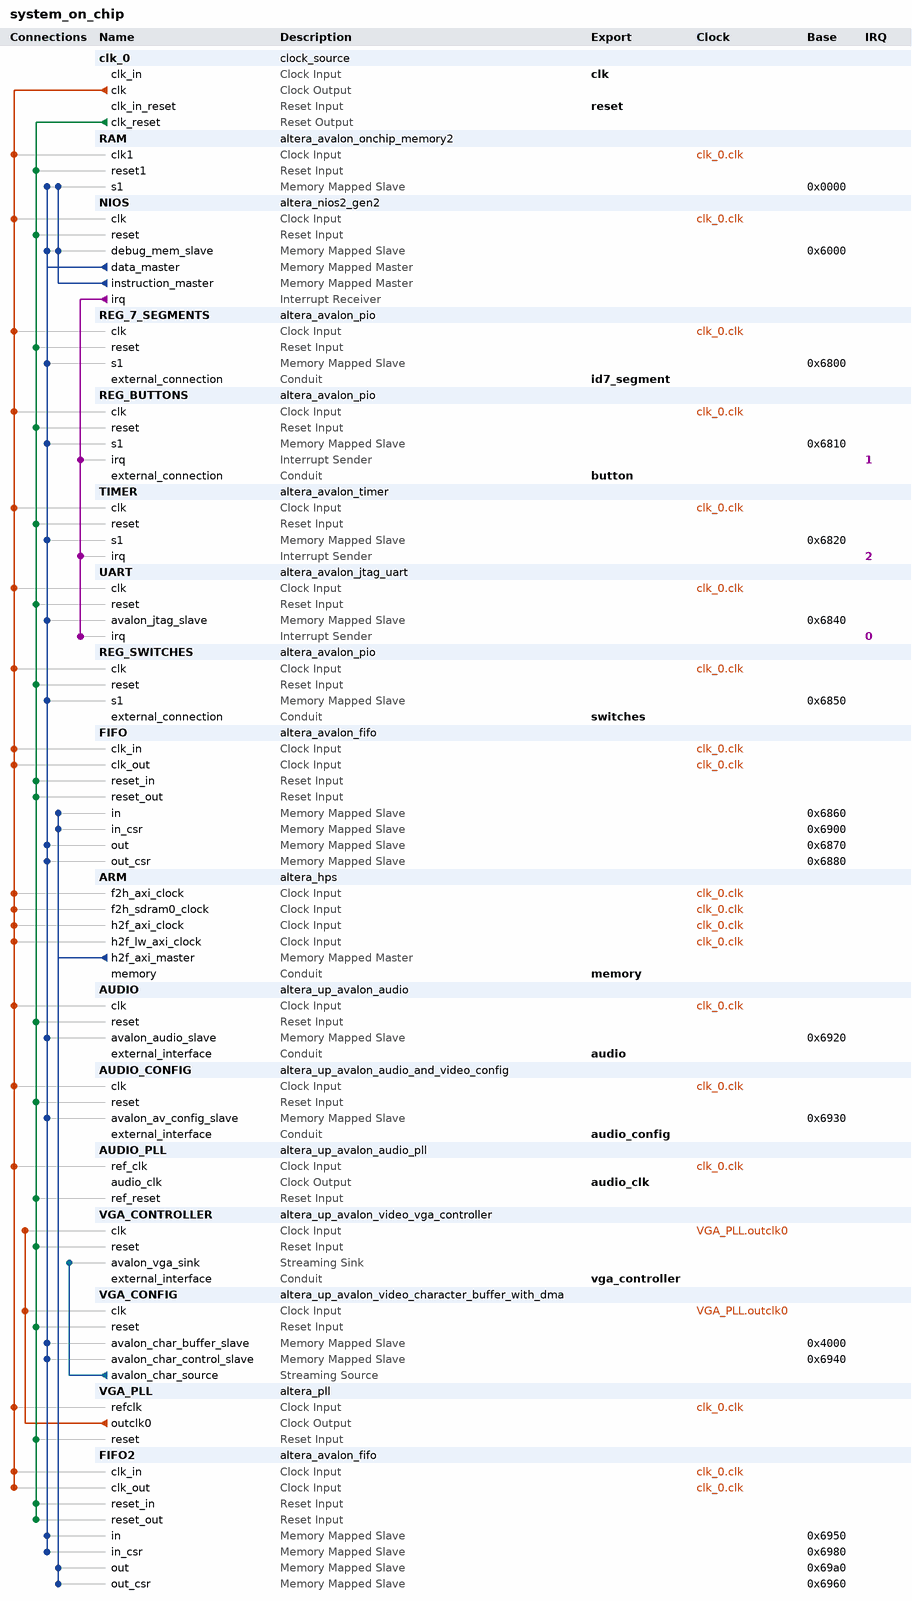
[diagram p0: system contents]
# Platform Designer (Qsys) system system_on_chip, Cyclone V 5CSEMA5F31C6
# Parameters at their usual value, and those the tool derives, are not listed.
package require -exact qsys 18.0
create_system system_on_chip
set_project_property DEVICE_FAMILY {Cyclone V}
set_project_property DEVICE 5CSEMA5F31C6

add_instance clk_0 clock_source 18.0
set_instance_parameter_value clk_0 clockFrequency 50000000

add_instance RAM altera_avalon_onchip_memory2 18.0
set_instance_parameter_value RAM dataWidth 16
set_instance_parameter_value RAM dualPort false
set_instance_parameter_value RAM initMemContent true
set_instance_parameter_value RAM initializationFileName onchip_mem.hex
set_instance_parameter_value RAM memorySize 16384

add_instance NIOS altera_nios2_gen2 18.0
set_instance_parameter_value NIOS dcache_size 2048
set_instance_parameter_value NIOS exceptionSlave RAM.s1
set_instance_parameter_value NIOS icache_size 4096
set_instance_parameter_value NIOS impl Tiny
set_instance_parameter_value NIOS resetSlave RAM.s1

add_instance REG_7_SEGMENTS altera_avalon_pio 18.0
set_instance_parameter_value REG_7_SEGMENTS direction Output
set_instance_parameter_value REG_7_SEGMENTS width 32

add_instance REG_BUTTONS altera_avalon_pio 18.0
set_instance_parameter_value REG_BUTTONS bitClearingEdgeCapReg true
set_instance_parameter_value REG_BUTTONS captureEdge true
set_instance_parameter_value REG_BUTTONS direction Input
set_instance_parameter_value REG_BUTTONS edgeType FALLING
set_instance_parameter_value REG_BUTTONS generateIRQ true
set_instance_parameter_value REG_BUTTONS irqType EDGE
set_instance_parameter_value REG_BUTTONS width 4

add_instance TIMER altera_avalon_timer 18.0
set_instance_parameter_value TIMER period 1
set_instance_parameter_value TIMER periodUnits MSEC

add_instance UART altera_avalon_jtag_uart 18.0
set_instance_parameter_value UART simInteractiveOptions NO_INTERACTIVE_WINDOWS

add_instance REG_SWITCHES altera_avalon_pio 18.0
set_instance_parameter_value REG_SWITCHES direction Input
set_instance_parameter_value REG_SWITCHES edgeType ANY
set_instance_parameter_value REG_SWITCHES width 8

add_instance FIFO altera_avalon_fifo 18.0
set_instance_parameter_value FIFO bitsPerSymbol 16
set_instance_parameter_value FIFO channelWidth 8
set_instance_parameter_value FIFO errorWidth 8
set_instance_parameter_value FIFO fifoDepth 16
set_instance_parameter_value FIFO fifoInputInterfaceOptions AVALONMM_WRITE
set_instance_parameter_value FIFO fifoOutputInterfaceOptions AVALONMM_READ
set_instance_parameter_value FIFO singleClockMode false
set_instance_parameter_value FIFO symbolsPerBeat 2
set_instance_parameter_value FIFO useIRQ true
set_instance_parameter_value FIFO usePacket true
set_instance_parameter_value FIFO useReadControl true

add_instance ARM altera_hps 18.0
set_instance_parameter_value ARM EMAC1_Mode N/A
set_instance_parameter_value ARM EMAC1_PinMuxing Unused
set_instance_parameter_value ARM F2SCLK_COLDRST_Enable false
set_instance_parameter_value ARM F2SCLK_DBGRST_Enable false
set_instance_parameter_value ARM F2SCLK_WARMRST_Enable false
set_instance_parameter_value ARM F2SDRAM_Type AXI-3
set_instance_parameter_value ARM F2SDRAM_Width 64
set_instance_parameter_value ARM F2SINTERRUPT_Enable false
set_instance_parameter_value ARM F2S_Width 2
set_instance_parameter_value ARM FPGA_PERIPHERAL_OUTPUT_CLOCK_FREQ_EMAC0_GTX_CLK 125
set_instance_parameter_value ARM FPGA_PERIPHERAL_OUTPUT_CLOCK_FREQ_EMAC0_MD_CLK 2.5
set_instance_parameter_value ARM FPGA_PERIPHERAL_OUTPUT_CLOCK_FREQ_EMAC1_GTX_CLK 125
set_instance_parameter_value ARM FPGA_PERIPHERAL_OUTPUT_CLOCK_FREQ_EMAC1_MD_CLK 2.5
set_instance_parameter_value ARM HPS_PROTOCOL DDR3
set_instance_parameter_value ARM I2C0_Mode N/A
set_instance_parameter_value ARM I2C0_PinMuxing Unused
set_instance_parameter_value ARM I2C1_Mode N/A
set_instance_parameter_value ARM I2C1_PinMuxing Unused
set_instance_parameter_value ARM LWH2F_Enable true
set_instance_parameter_value ARM MEM_BANKADDR_WIDTH 3
set_instance_parameter_value ARM MEM_CLK_FREQ 300.0
set_instance_parameter_value ARM MEM_CLK_FREQ_MAX 400.0
set_instance_parameter_value ARM MEM_COL_ADDR_WIDTH 8
set_instance_parameter_value ARM MEM_DQ_WIDTH 8
set_instance_parameter_value ARM MEM_DRV_STR RZQ/6
set_instance_parameter_value ARM MEM_ROW_ADDR_WIDTH 12
set_instance_parameter_value ARM MEM_RTT_NOM {ODT Disabled}
set_instance_parameter_value ARM MEM_RTT_WR {Dynamic ODT off}
set_instance_parameter_value ARM MEM_TCL 7
set_instance_parameter_value ARM MEM_TFAW_NS 37.5
set_instance_parameter_value ARM MEM_TINIT_US 499
set_instance_parameter_value ARM MEM_TMRD_CK 3
set_instance_parameter_value ARM MEM_TRAS_NS 40.0
set_instance_parameter_value ARM MEM_TRCD_NS 15.0
set_instance_parameter_value ARM MEM_TREFI_US 7.0
set_instance_parameter_value ARM MEM_TRFC_NS 75.0
set_instance_parameter_value ARM MEM_TRP_NS 15.0
set_instance_parameter_value ARM MEM_TWTR 2
set_instance_parameter_value ARM MEM_VENDOR JEDEC
set_instance_parameter_value ARM MEM_WTCL 6
set_instance_parameter_value ARM MPU_EVENTS_Enable true
set_instance_parameter_value ARM QSPI_Mode N/A
set_instance_parameter_value ARM QSPI_PinMuxing Unused
set_instance_parameter_value ARM REF_CLK_FREQ 125.0
set_instance_parameter_value ARM S2FCLK_USER2CLK 5
set_instance_parameter_value ARM S2F_Width 2
set_instance_parameter_value ARM SDIO_Mode N/A
set_instance_parameter_value ARM SDIO_PinMuxing Unused
set_instance_parameter_value ARM SPIM1_Mode N/A
set_instance_parameter_value ARM SPIM1_PinMuxing Unused
set_instance_parameter_value ARM STM_Enable false
set_instance_parameter_value ARM TIMING_BOARD_AC_SKEW 0.02
set_instance_parameter_value ARM TIMING_BOARD_AC_TO_CK_SKEW 0.0
set_instance_parameter_value ARM TIMING_BOARD_DQ_TO_DQS_SKEW 0.0
set_instance_parameter_value ARM TIMING_BOARD_MAX_CK_DELAY 0.6
set_instance_parameter_value ARM TIMING_BOARD_MAX_DQS_DELAY 0.6
set_instance_parameter_value ARM TIMING_BOARD_SKEW_BETWEEN_DQS 0.02
set_instance_parameter_value ARM TIMING_BOARD_SKEW_CKDQS_DIMM_MAX 0.01
set_instance_parameter_value ARM TIMING_BOARD_SKEW_CKDQS_DIMM_MIN -0.01
set_instance_parameter_value ARM TIMING_BOARD_SKEW_WITHIN_DQS 0.02
set_instance_parameter_value ARM TIMING_TDH 125
set_instance_parameter_value ARM TIMING_TDQSCK 400
set_instance_parameter_value ARM TIMING_TDQSQ 120
set_instance_parameter_value ARM TIMING_TDS 50
set_instance_parameter_value ARM TIMING_TIH 250
set_instance_parameter_value ARM TIMING_TIS 175
set_instance_parameter_value ARM TIMING_TQSH 0.38
set_instance_parameter_value ARM UART0_Mode N/A
set_instance_parameter_value ARM UART0_PinMuxing Unused
set_instance_parameter_value ARM USB1_Mode N/A
set_instance_parameter_value ARM USB1_PinMuxing Unused
set_instance_parameter_value ARM desired_cfg_clk_mhz 100.0
set_instance_parameter_value ARM desired_qspi_clk_mhz 400.0

add_instance AUDIO altera_up_avalon_audio 18.0
set_instance_parameter_value AUDIO audio_in false
set_instance_parameter_value AUDIO avalon_bus_type {Memory Mapped}
set_instance_parameter_value AUDIO dw 32

add_instance AUDIO_CONFIG altera_up_avalon_audio_and_video_config 18.0
set_instance_parameter_value AUDIO_CONFIG audio_in {Microphone to ADC}
set_instance_parameter_value AUDIO_CONFIG bit_length 32
set_instance_parameter_value AUDIO_CONFIG board DE1-SoC
set_instance_parameter_value AUDIO_CONFIG data_format {I2S Format}
set_instance_parameter_value AUDIO_CONFIG line_in_bypass false
set_instance_parameter_value AUDIO_CONFIG sampling_rate {48 kHz}

add_instance AUDIO_PLL altera_up_avalon_audio_pll 18.0
set_instance_parameter_value AUDIO_PLL audio_clk_freq 18.432
set_instance_parameter_value AUDIO_PLL gui_refclk 50.0

add_instance VGA_CONTROLLER altera_up_avalon_video_vga_controller 18.0
set_instance_parameter_value VGA_CONTROLLER board DE1-SoC
set_instance_parameter_value VGA_CONTROLLER resolution {VGA 640x480}

add_instance VGA_CONFIG altera_up_avalon_video_character_buffer_with_dma 18.0
set_instance_parameter_value VGA_CONFIG enable_transparency false

add_instance VGA_PLL altera_pll 18.0
set_instance_parameter_value VGA_PLL gui_device_speed_grade 1
set_instance_parameter_value VGA_PLL gui_number_of_clocks 1
set_instance_parameter_value VGA_PLL gui_operation_mode direct
set_instance_parameter_value VGA_PLL gui_output_clock_frequency0 25.0
set_instance_parameter_value VGA_PLL gui_pll_mode {Integer-N PLL}
set_instance_parameter_value VGA_PLL gui_reference_clock_frequency 50.0
set_instance_parameter_value VGA_PLL gui_use_locked true

add_instance FIFO2 altera_avalon_fifo 18.0
set_instance_parameter_value FIFO2 bitsPerSymbol 16
set_instance_parameter_value FIFO2 channelWidth 8
set_instance_parameter_value FIFO2 errorWidth 8
set_instance_parameter_value FIFO2 fifoDepth 16
set_instance_parameter_value FIFO2 fifoInputInterfaceOptions AVALONMM_WRITE
set_instance_parameter_value FIFO2 fifoOutputInterfaceOptions AVALONMM_READ
set_instance_parameter_value FIFO2 singleClockMode false
set_instance_parameter_value FIFO2 symbolsPerBeat 2
set_instance_parameter_value FIFO2 useIRQ true
set_instance_parameter_value FIFO2 usePacket true
set_instance_parameter_value FIFO2 useReadControl true

# connections
add_connection clk_0.clk ARM.f2h_axi_clock clock
add_connection clk_0.clk ARM.f2h_sdram0_clock clock
add_connection clk_0.clk ARM.h2f_axi_clock clock
add_connection clk_0.clk ARM.h2f_lw_axi_clock clock
add_connection clk_0.clk AUDIO.clk clock
add_connection clk_0.clk AUDIO_CONFIG.clk clock
add_connection clk_0.clk AUDIO_PLL.ref_clk clock
add_connection clk_0.clk FIFO2.clk_in clock
add_connection clk_0.clk FIFO2.clk_out clock
add_connection clk_0.clk FIFO.clk_in clock
add_connection clk_0.clk FIFO.clk_out clock
add_connection clk_0.clk NIOS.clk clock
add_connection clk_0.clk RAM.clk1 clock
add_connection clk_0.clk REG_7_SEGMENTS.clk clock
add_connection clk_0.clk REG_BUTTONS.clk clock
add_connection clk_0.clk REG_SWITCHES.clk clock
add_connection clk_0.clk TIMER.clk clock
add_connection clk_0.clk UART.clk clock
add_connection clk_0.clk VGA_PLL.refclk clock
add_connection VGA_PLL.outclk0 VGA_CONFIG.clk clock
add_connection VGA_PLL.outclk0 VGA_CONTROLLER.clk clock
add_connection clk_0.clk_reset AUDIO.reset reset
add_connection clk_0.clk_reset AUDIO_CONFIG.reset reset
add_connection clk_0.clk_reset AUDIO_PLL.ref_reset reset
add_connection clk_0.clk_reset FIFO2.reset_in reset
add_connection clk_0.clk_reset FIFO2.reset_out reset
add_connection clk_0.clk_reset FIFO.reset_in reset
add_connection clk_0.clk_reset FIFO.reset_out reset
add_connection clk_0.clk_reset NIOS.reset reset
add_connection clk_0.clk_reset RAM.reset1 reset
add_connection clk_0.clk_reset REG_7_SEGMENTS.reset reset
add_connection clk_0.clk_reset REG_BUTTONS.reset reset
add_connection clk_0.clk_reset REG_SWITCHES.reset reset
add_connection clk_0.clk_reset TIMER.reset reset
add_connection clk_0.clk_reset UART.reset reset
add_connection clk_0.clk_reset VGA_CONFIG.reset reset
add_connection clk_0.clk_reset VGA_CONTROLLER.reset reset
add_connection clk_0.clk_reset VGA_PLL.reset reset
add_connection ARM.h2f_axi_master FIFO2.out avalon
set_connection_parameter_value ARM.h2f_axi_master/FIFO2.out baseAddress 0x69a0
add_connection ARM.h2f_axi_master FIFO2.out_csr avalon
set_connection_parameter_value ARM.h2f_axi_master/FIFO2.out_csr baseAddress 0x6960
add_connection ARM.h2f_axi_master FIFO.in avalon
set_connection_parameter_value ARM.h2f_axi_master/FIFO.in baseAddress 0x6860
add_connection ARM.h2f_axi_master FIFO.in_csr avalon
set_connection_parameter_value ARM.h2f_axi_master/FIFO.in_csr baseAddress 0x6900
add_connection NIOS.data_master AUDIO.avalon_audio_slave avalon
set_connection_parameter_value NIOS.data_master/AUDIO.avalon_audio_slave baseAddress 0x6920
add_connection NIOS.data_master AUDIO_CONFIG.avalon_av_config_slave avalon
set_connection_parameter_value NIOS.data_master/AUDIO_CONFIG.avalon_av_config_slave baseAddress 0x6930
add_connection NIOS.data_master FIFO2.in avalon
set_connection_parameter_value NIOS.data_master/FIFO2.in baseAddress 0x6950
add_connection NIOS.data_master FIFO2.in_csr avalon
set_connection_parameter_value NIOS.data_master/FIFO2.in_csr baseAddress 0x6980
add_connection NIOS.data_master FIFO.out avalon
set_connection_parameter_value NIOS.data_master/FIFO.out baseAddress 0x6870
add_connection NIOS.data_master FIFO.out_csr avalon
set_connection_parameter_value NIOS.data_master/FIFO.out_csr baseAddress 0x6880
add_connection NIOS.data_master NIOS.debug_mem_slave avalon
set_connection_parameter_value NIOS.data_master/NIOS.debug_mem_slave baseAddress 0x6000
add_connection NIOS.data_master RAM.s1 avalon
set_connection_parameter_value NIOS.data_master/RAM.s1 baseAddress 0x0000
add_connection NIOS.data_master REG_7_SEGMENTS.s1 avalon
set_connection_parameter_value NIOS.data_master/REG_7_SEGMENTS.s1 baseAddress 0x6800
add_connection NIOS.data_master REG_BUTTONS.s1 avalon
set_connection_parameter_value NIOS.data_master/REG_BUTTONS.s1 baseAddress 0x6810
add_connection NIOS.data_master REG_SWITCHES.s1 avalon
set_connection_parameter_value NIOS.data_master/REG_SWITCHES.s1 baseAddress 0x6850
add_connection NIOS.data_master TIMER.s1 avalon
set_connection_parameter_value NIOS.data_master/TIMER.s1 baseAddress 0x6820
add_connection NIOS.data_master UART.avalon_jtag_slave avalon
set_connection_parameter_value NIOS.data_master/UART.avalon_jtag_slave baseAddress 0x6840
add_connection NIOS.data_master VGA_CONFIG.avalon_char_buffer_slave avalon
set_connection_parameter_value NIOS.data_master/VGA_CONFIG.avalon_char_buffer_slave baseAddress 0x4000
add_connection NIOS.data_master VGA_CONFIG.avalon_char_control_slave avalon
set_connection_parameter_value NIOS.data_master/VGA_CONFIG.avalon_char_control_slave baseAddress 0x6940
add_connection NIOS.instruction_master NIOS.debug_mem_slave avalon
set_connection_parameter_value NIOS.instruction_master/NIOS.debug_mem_slave baseAddress 0x6000
add_connection NIOS.instruction_master RAM.s1 avalon
set_connection_parameter_value NIOS.instruction_master/RAM.s1 baseAddress 0x0000
add_connection VGA_CONFIG.avalon_char_source VGA_CONTROLLER.avalon_vga_sink avalon_streaming
add_connection NIOS.irq REG_BUTTONS.irq interrupt
set_connection_parameter_value NIOS.irq/REG_BUTTONS.irq irqNumber 1
add_connection NIOS.irq TIMER.irq interrupt
set_connection_parameter_value NIOS.irq/TIMER.irq irqNumber 2
add_connection NIOS.irq UART.irq interrupt
set_connection_parameter_value NIOS.irq/UART.irq irqNumber 0

# exported interfaces
add_interface audio conduit end
set_interface_property audio EXPORT_OF AUDIO.external_interface
add_interface audio_clk clock source
set_interface_property audio_clk EXPORT_OF AUDIO_PLL.audio_clk
add_interface audio_config conduit end
set_interface_property audio_config EXPORT_OF AUDIO_CONFIG.external_interface
add_interface button conduit end
set_interface_property button EXPORT_OF REG_BUTTONS.external_connection
add_interface clk clock sink
set_interface_property clk EXPORT_OF clk_0.clk_in
add_interface id7_segment conduit end
set_interface_property id7_segment EXPORT_OF REG_7_SEGMENTS.external_connection
add_interface memory conduit end
set_interface_property memory EXPORT_OF ARM.memory
add_interface reset reset sink
set_interface_property reset EXPORT_OF clk_0.clk_in_reset
add_interface switches conduit end
set_interface_property switches EXPORT_OF REG_SWITCHES.external_connection
add_interface vga_controller conduit end
set_interface_property vga_controller EXPORT_OF VGA_CONTROLLER.external_interface

set_interconnect_requirement {$system} qsys_mm.clockCrossingAdapter HANDSHAKE
set_interconnect_requirement {$system} qsys_mm.enableEccProtection FALSE
set_interconnect_requirement {$system} qsys_mm.insertDefaultSlave FALSE
set_interconnect_requirement {$system} qsys_mm.maxAdditionalLatency 1

save_system system_on_chip.qsys
